# EAGLE schematic uBridge4x4r1 (EAGLE 6.2)
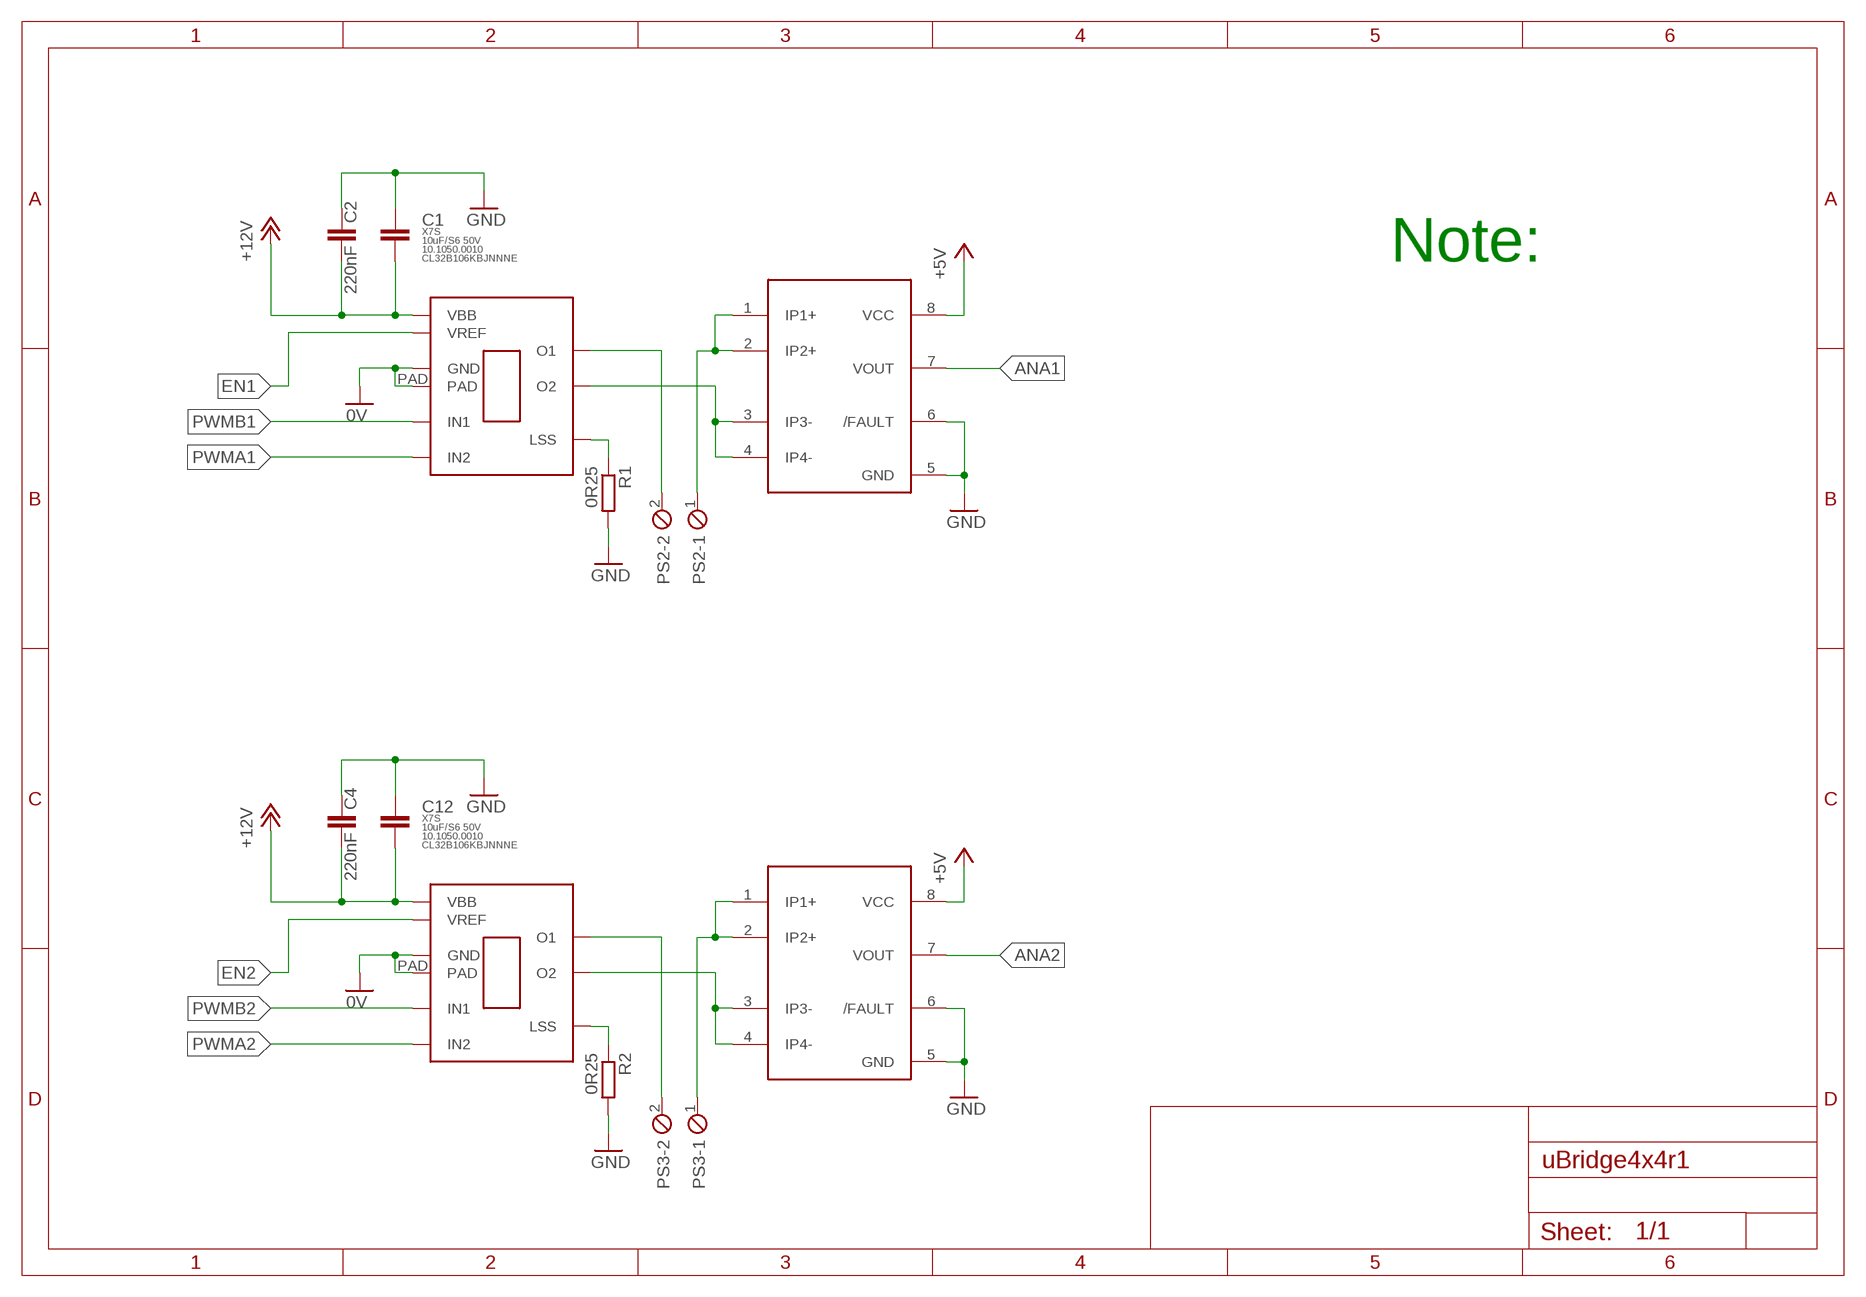
[diagram p0: schematic, sheet 1, part 1 of 2]
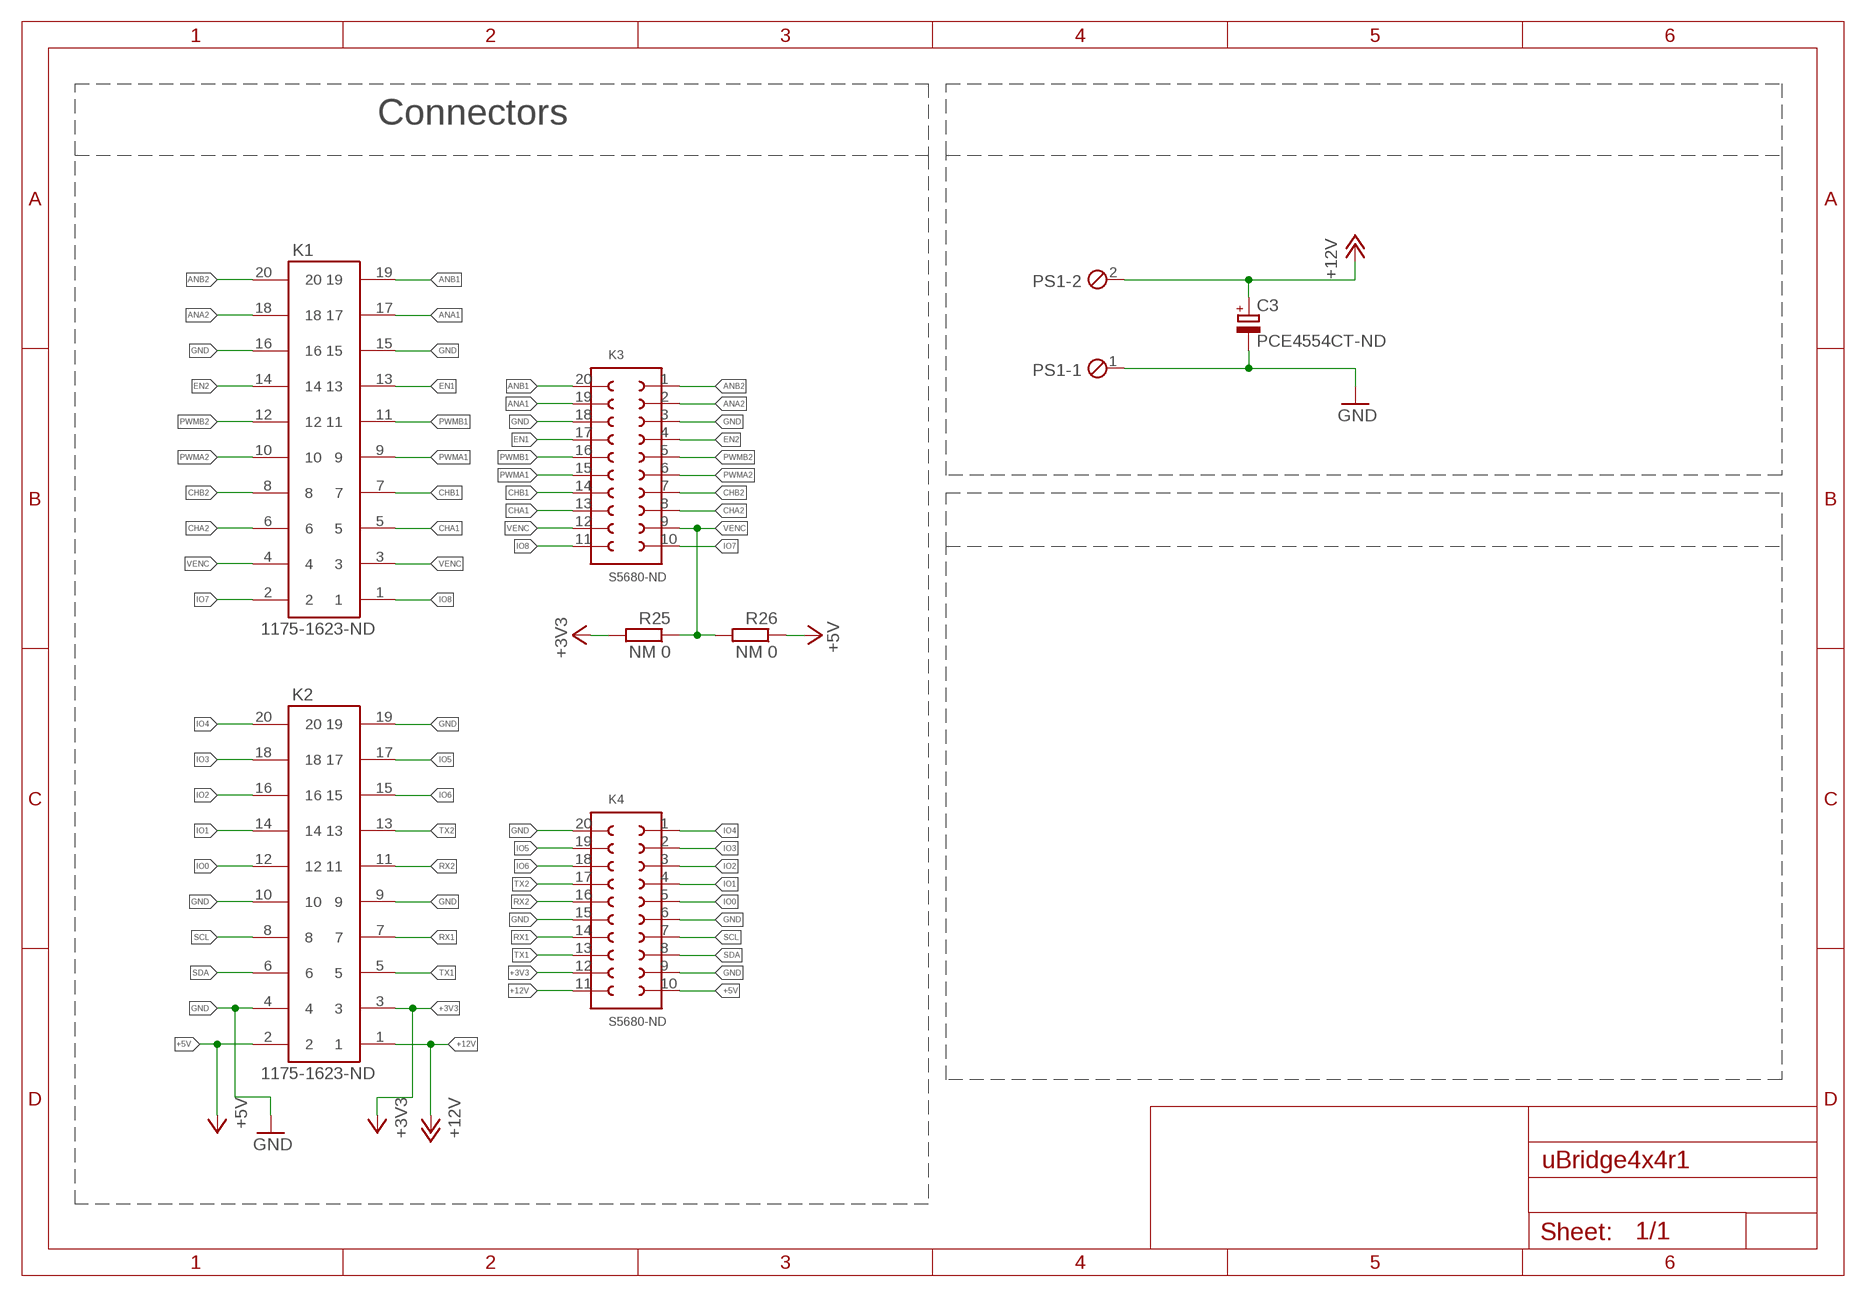
[diagram p1: schematic, sheet 1, part 2 of 2]

## Parts
C1  10uF/S6 50V  C-EUC3225  [C3225]
C2  220nF  C-EUC0805K  [C0805K]
C3  PCE4554CT-ND  CPOL-EUUD-6,3X7,7  [UD-6,3X7,7_NICHICON]
C4  220nF  C-EUC0805K  [C0805K]
C12  10uF/S6 50V  C-EUC3225  [C3225]
K1  1175-1623-ND  612X2020621  [612X2020621]
K2  1175-1623-ND  612X2020621  [612X2020621]
K3  S5680-ND  61002021821  [61002021821]
K4  S5680-ND  61002021821  [61002021821]
PS1  MPT2  [2POL254]
PS2  MPT2  [2POL254]
PS3  MPT2  [2POL254]
R1  0R25  R-EU_R1206  [R1206]
R2  0R25  R-EU_R1206  [R1206]
R25  NM 0  R-EU_R0603  [R0603]
R26  NM 0  R-EU_R0603  [R0603]
U$1  A4950  [SOICN]
U$2  A4950  [SOICN]
U$3  ACS723  ACS711  [SO08]
U$4  ACS723  ACS711  [SO08]

## Nets
+3V3: K2.3 K4.12 R25.2
+5V: K2.2 K4.10 R26.1 U$3.8(VCC) U$4.8(VCC)
+12V: C1.2 C2.2 C3.+ C4.2 C12.2 K2.1 K4.11 PS1.2 U$1.5VCC(VBB) U$2.5VCC(VBB)
ANA1: K1.17 K3.19 U$3.7(VOUT)
ANA2: K1.18 K3.2 U$4.7(VOUT)
ANB1: K1.19 K3.20
ANB2: K1.20 K3.1
CHA1: K1.5 K3.13
CHA2: K1.6 K3.8
CHB1: K1.7 K3.14
CHB2: K1.8 K3.7
EN1: K1.13 K3.17 U$1.4CS(VREF)
EN2: K1.14 K3.4 U$2.4CS(VREF)
GND: C1.1 C2.1 C3.- C4.1 C12.1 K1.15 K1.16 K2.4 K2.9 K2.10 K2.19 K3.3 K3.18 K4.6 K4.9 K4.15 K4.20 PS1.1 R1.2 R2.2 U$1.1VIN(GND) U$1.PAD U$2.1VIN(GND) U$2.PAD U$3.5(GND) U$3.6(/FAULT) U$4.5(GND) U$4.6(/FAULT) ; supply symbol labelled 0V
IO0: K2.12 K4.5
IO1: K2.14 K4.4
IO2: K2.16 K4.3
IO3: K2.18 K4.2
IO4: K2.20 K4.1
IO5: K2.17 K4.19
IO6: K2.15 K4.18
IO7: K1.2 K3.10
IO8: K1.1 K3.11
N$1: R2.1 U$2.7BOOT(LSS)
N$2: PS3.2 U$2.6GND(O1)
N$3: U$2.8SW(O2) U$4.3(IP3-) U$4.4(IP4-)
N$6: PS2.1 U$3.1(IP1+) U$3.2(IP2+)
N$8: PS2.2 U$1.6GND(O1)
N$9: PS3.1 U$4.1(IP1+) U$4.2(IP2+)
N$10: R1.1 U$1.7BOOT(LSS)
N$12: U$1.8SW(O2) U$3.3(IP3-) U$3.4(IP4-)
PWMA1: K1.9 K3.15 U$1.2TON(IN2)
PWMA2: K1.10 K3.6 U$2.2TON(IN2)
PWMB1: K1.11 K3.16 U$1.3EN(IN1)
PWMB2: K1.12 K3.5 U$2.3EN(IN1)
RX1: K2.7 K4.14
RX2: K2.11 K4.16
SCL: K2.8 K4.7
SDA: K2.6 K4.8
TX1: K2.5 K4.13
TX2: K2.13 K4.17
VENC: K1.3 K1.4 K3.9 K3.12 R25.1 R26.2

## Notes on the sheet
- Connectors
- Note:

## Library data of the parts
C1 C12 = rcl:C-EU: CAPACITOR, European symbol; CASE: C3225 [EIA CC1210]; CODE: CL32B106KBJNNNE; KATODO: 10.1050.0010; TEMPERATURE: X7S
C2 C4 = rcl:C-EU: CAPACITOR, European symbol
C3 = rcl:CPOL-EU: POLARIZED CAPACITOR, European symbol
K1 K2 = Wuerth_Elektronik_eiCan_Wire_to_Board_Connectors:612X2020621: WR-BHD 2.54mm Male SMT Box Header High Temperature, 20 Pins=>Code : Con_WTB_BHD_2.54_Male_SMT_612X2020621 <http://katalog.we-online.de/media/thumbs2/eican/thb_Con_WTB_BHD_2.54_Male_SMT_6120xx20621_pf2.jpg> Details see: http://katalog.we-online.de/en/em/612_0xx_206_21 Created 2014-06-05, Karrer Zheng 2014 (C) Würth Elektronik
K3 K4 = Wuerth_Elektronik_eiCan_Board_to_Board_Connectors:61002021821: WR-PHD 2.54mm Dual SMT Socket Header, 20 Pins=>Code : Con_BTB_SHD_2.54_1_SMT_61002021821 <http://katalog.we-online.de/media/images/eican/Con_BTB_SHD_2.54_1_SMT_6100xx21821_pf2.jpg> Details see: http://katalog.we-online.de/en/em/610_0xx_218_21 Created 2014-05-30, Karrer Zheng 2014 (C) Würth Elektronik
PS1-PS3 = Personale:MPT2: PHOENIX CONNECTOR
R1 R2 R25 R26 = rcl:R-EU_: RESISTOR, European symbol
U$1 U$2 = allegro:A4950
U$3 U$4 = allegro:ACS711

## Net classes
0 default: width 0.203 mm, clearance 0.203 mm
1 power: width 0.305 mm, clearance 0.203 mm